# Altium schematic sheet 4.INTERFACE.SchDoc
size A4
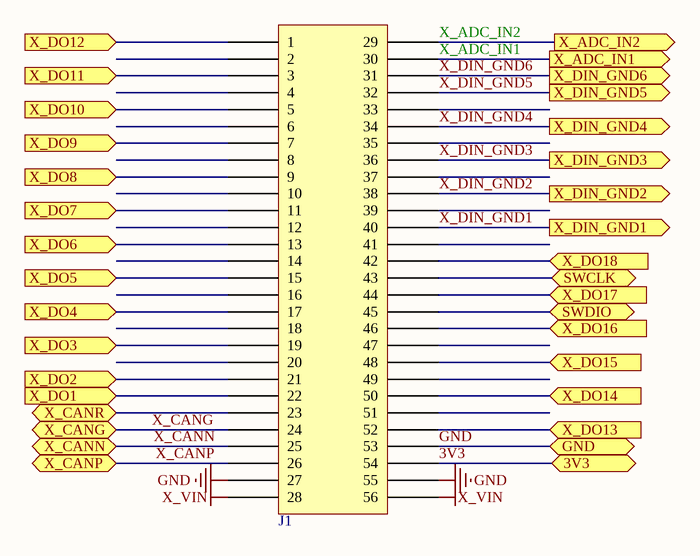
[diagram p0: 4.INTERFACE.SchDoc]

## Parts
J1  HEADER56  [Connector PIN56]  (value not drawn)

## Ports
3V3 (bidir), GND (bidir), SWCLK (bidir), SWDIO (bidir), X_ADC_IN1 (out), X_ADC_IN2 (out), X_CANG (bidir), X_CANN (bidir), X_CANP (bidir), X_CANR (bidir), X_DIN_GND1 (out), X_DIN_GND2 (out), X_DIN_GND3 (out), X_DIN_GND4 (out), X_DIN_GND5 (out), X_DIN_GND6 (out), X_DO1 (in), X_DO2 (in), X_DO3 (in), X_DO4 (in), X_DO5 (in), X_DO6 (in), X_DO7 (in), X_DO8 (in), X_DO9 (in), X_DO10 (in), X_DO11 (in), X_DO12 (in), X_DO13 (in), X_DO14 (in), X_DO15 (in), X_DO16 (in), X_DO17 (in), X_DO18 (in)

## Nets
GND: J1.27 J1.53 J1.55 ; port GND
X_VIN: J1.28 J1.56
3V3: J1.54 ; port 3V3
SWCLK: J1.43 ; port SWCLK
SWDIO: J1.45 ; port SWDIO
X_ADC_IN1: J1.30 ; port X_ADC_IN1
X_ADC_IN2: J1.29 ; port X_ADC_IN2
X_CANG: J1.24 ; port X_CANG
X_CANN: J1.25 ; port X_CANN
X_CANP: J1.26 ; port X_CANP
X_CANR: J1.23 ; port X_CANR
X_DIN_GND1: J1.40 ; port X_DIN_GND1
X_DIN_GND2: J1.38 ; port X_DIN_GND2
X_DIN_GND3: J1.36 ; port X_DIN_GND3
X_DIN_GND4: J1.34 ; port X_DIN_GND4
X_DIN_GND5: J1.32 ; port X_DIN_GND5
X_DIN_GND6: J1.31 ; port X_DIN_GND6
X_DO1: J1.22 ; port X_DO1
X_DO2: J1.21 ; port X_DO2
X_DO3: J1.19 ; port X_DO3
X_DO4: J1.17 ; port X_DO4
X_DO5: J1.15 ; port X_DO5
X_DO6: J1.13 ; port X_DO6
X_DO7: J1.11 ; port X_DO7
X_DO8: J1.9 ; port X_DO8
X_DO9: J1.7 ; port X_DO9
X_DO10: J1.5 ; port X_DO10
X_DO11: J1.3 ; port X_DO11
X_DO12: J1.1 ; port X_DO12
X_DO13: J1.52 ; port X_DO13
X_DO14: J1.50 ; port X_DO14
X_DO15: J1.48 ; port X_DO15
X_DO16: J1.46 ; port X_DO16
X_DO17: J1.44 ; port X_DO17
X_DO18: J1.42 ; port X_DO18

Not connected (* = marked no-connect by the designer): J1 2 4 6 8 10 12 14 16 18 20 33 35 37 39 41 47 49 51